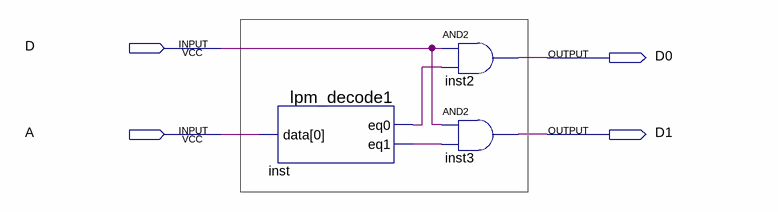
[diagram p0: schematic sheet]
// Quartus schematic DMUX.bdf as structural Verilog: 3 symbols, 4 pins
module DMUX (
  input  D,
  input  A,
  output D0,
  output D1
);

  wire inst_eq0, inst_eq1;

  lpm_decode1 inst (.data(A), .eq0(inst_eq0), .eq1(inst_eq1));
  and inst2 (D0, D, inst_eq0);
  and inst3 (D1, D, inst_eq1);
endmodule
